# Altium schematic sheet LED.SchDoc
size A4
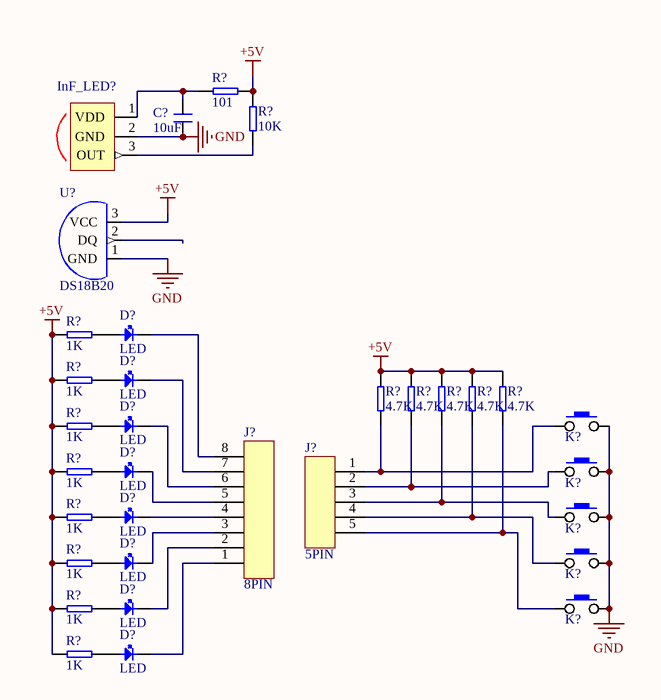
[diagram p0: LED.SchDoc]

## Parts
(Parts that share a designator on the sheet are numbered #1, #2 ... from top to bottom, then left to right.)
C?  10uF  [RES]
D?#1  LED  [LED0805]
D?#2  LED  [LED0805]
D?#3  LED  [LED0805]
D?#4  LED  [LED0805]
D?#5  LED  [LED0805]
D?#6  LED  [LED0805]
D?#7  LED  [LED0805]
D?#8  LED  [LED0805]
InF_LED?  Infrared_LED  [3PIN]  (value not drawn)
J?#1  5PIN  [5PIN]
J?#2  8PIN  [8PIN]
K?#1  KEY  [KEY]  (value not drawn)
K?#2  KEY  [KEY]  (value not drawn)
K?#3  KEY  [KEY]  (value not drawn)
K?#4  KEY  [KEY]  (value not drawn)
K?#5  KEY  [KEY]  (value not drawn)
R?#1  101  [RES0805]
R?#2  10K  [RES0805]
R?#3  1K  [RES0805]
R?#4  1K  [RES0805]
R?#5  4.7K  [RES0805]
R?#6  4.7K  [RES0805]
R?#7  4.7K  [RES0805]
R?#8  4.7K  [RES0805]
R?#9  4.7K  [RES0805]
R?#10  1K  [RES0805]
R?#11  1K  [RES0805]
R?#12  1K  [RES0805]
R?#13  1K  [RES0805]
R?#14  1K  [RES0805]
R?#15  1K  [RES0805]
U?  DS18B20  [3PIN]

## Nets
+5V: R?#1.2 R?#2.2 R?#3.1 R?#4.1 R?#5.2 R?#6.2 R?#7.2 R?#8.2 R?#9.2 R?#10.1 R?#11.1 R?#12.1 R?#13.1 R?#14.1 R?#15.1 U?.3(VCC)
GND: C?.1 InF_LED?.2(GND) K?#1.2 K?#2.2 K?#3.2 K?#4.2 K?#5.2 U?.1(GND)
NetC?_2: C?.2 InF_LED?.1(VDD) R?#1.1
NetD?#1_1: D?#1.1(A) R?#3.2
NetD?#1_2: D?#1.2(K) J?#2.8
NetD?#2_1: D?#2.1(A) R?#4.2
NetD?#2_2: D?#2.2(K) J?#2.7
NetD?#3_1: D?#3.1(A) R?#10.2
NetD?#3_2: D?#3.2(K) J?#2.6
NetD?#4_1: D?#4.1(A) R?#11.2
NetD?#4_2: D?#4.2(K) J?#2.5
NetD?#5_1: D?#5.1(A) R?#12.2
NetD?#5_2: D?#5.2(K) J?#2.4
NetD?#6_1: D?#6.1(A) R?#13.2
NetD?#6_2: D?#6.2(K) J?#2.3
NetD?#7_1: D?#7.1(A) R?#14.2
NetD?#7_2: D?#7.2(K) J?#2.2
NetD?#8_1: D?#8.1(A) R?#15.2
NetD?#8_2: D?#8.2(K) J?#2.1
NetInF_LED?_3: InF_LED?.3(OUT) R?#2.1
NetJ?#1_1: J?#1.1 K?#1.1 R?#5.1
NetJ?#1_2: J?#1.2 K?#2.1 R?#6.1
NetJ?#1_3: J?#1.3 K?#3.1 R?#7.1
NetJ?#1_4: J?#1.4 K?#4.1 R?#8.1
NetJ?#1_5: J?#1.5 K?#5.1 R?#9.1

Not connected (* = marked no-connect by the designer): U? 2(DQ)

## Library data of the parts
C? = CAP2
R?#1-R?#15 = RES